# EAGLE design mimic1705 (EAGLE 7.5.0)
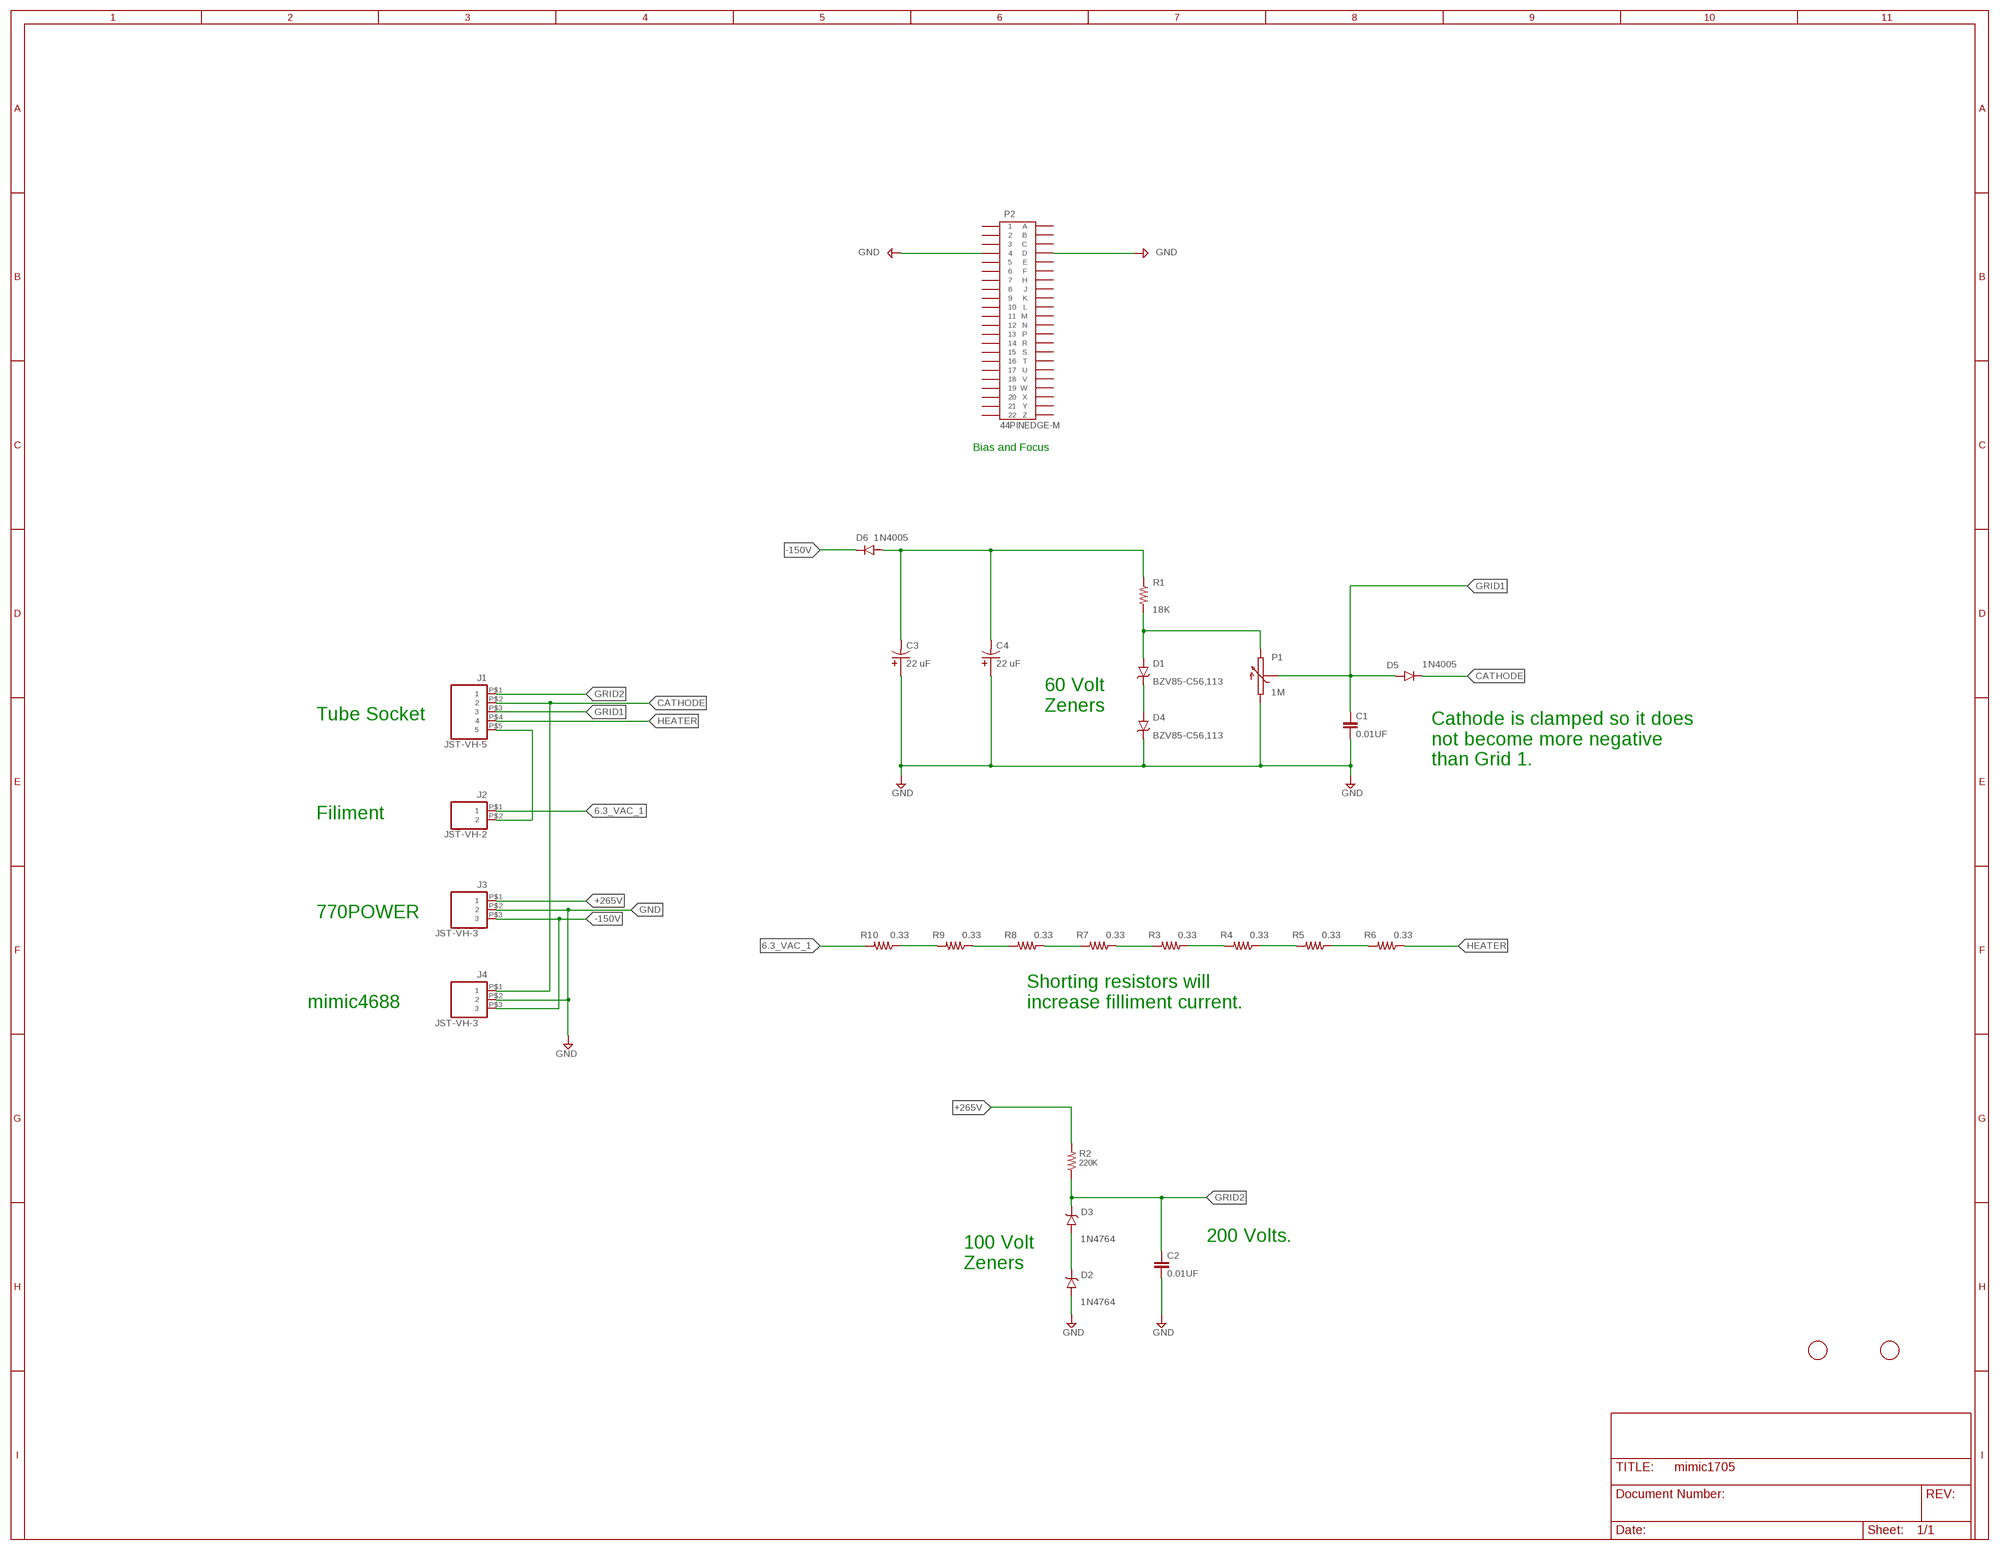
[diagram p0: schematic, sheet 1]

## Parts
C1  0.01UF  CAP_5MM  [5MM_TH]
C2  0.01UF  CAP_5MM  [5MM_TH]
C3  22 uF  CAP100UF200V  [AXIAL10X26]
C4  22 uF  CAP100UF200V  [AXIAL10X26]
D1  BZV85-C56,113  [DO-41-10]
D2  1N4764  1N4764A  [DO-41-10]
D3  1N4764  1N4764A  [DO-41-10]
D4  BZV85-C56,113  [DO-41-10]
D5  1N4005  1N400X  [DO-41-10]
D6  1N4005  1N400X  [DO-41-10]
J1  JST-VH-5  [VHR-5N]
J2  JST-VH-2  [VHR-2N]
J3  JST-VH-3  [VHR-3N]
J4  JST-VH-3  [VHR-3N]
P1  1M  POT-3006P  [3006P]
P2  44PINEDGE-M  [44PINEDGE]
R1  18K  RES-V  [0207/10]
R2  220K  RES-V  [0207/10]
R3  0.33  R-1/2WATT  [0309/12]
R4  0.33  R-1/2WATT  [0309/12]
R5  0.33  R-1/2WATT  [0309/12]
R6  0.33  R-1/2WATT  [0309/12]
R7  0.33  R-1/2WATT  [0309/12]
R8  0.33  R-1/2WATT  [0309/12]
R9  0.33  R-1/2WATT  [0309/12]
R10  0.33  R-1/2WATT  [0309/12]
U$1  FIDUCIAL  [FIDUCIAL_1MM]
U$2  FIDUCIAL  [FIDUCIAL_1MM]

## Nets
6.3_VAC_1: J2.P$1 R10.2
6.3_VAC_2: J1.P$5 J2.P$2
+265V: J3.P$1 R2.2
-150V: D6.C J3.P$3 J4.P$3
CATHODE: D5.C J1.P$2 J4.P$1
GND: C1.2 C2.2 C3.P$1 C4.P$1 D2.A D4.C J3.P$2 J4.P$2 P1.1 P2.4 P2.D
GRID1: C1.1 D5.A J1.P$3 P1.2
GRID2: C2.1 D3.C J1.P$1 R2.1
HEATER: J1.P$4 R6.1
N$1: D1.C D4.A
N$2: D2.C D3.A
N$5: R9.2 R10.1
N$7: D1.A P1.3 R1.2
N$8: C3.P$2 C4.P$2 D6.A R1.1
N$9: R8.2 R9.1
N$10: R7.2 R8.1
N$11: R3.2 R7.1
N$12: R3.1 R4.2
N$13: R4.1 R5.2
N$14: R5.1 R6.2
Unconnected: P2.1 P2.2 P2.3 P2.5 P2.6 P2.7 P2.8 P2.9 P2.10 P2.11 P2.12 P2.13 P2.14 P2.15 P2.16 P2.17 P2.18 P2.19 P2.20 P2.21 P2.22 P2.A P2.B P2.C P2.E P2.F P2.H P2.J P2.K P2.L P2.M P2.N P2.P P2.R P2.S P2.T P2.U P2.V P2.W P2.X P2.Y P2.Z

## Notes on the sheet
- Bias and Focus
- 60 Volt 
  Zeners
- Tube Socket
- Cathode is clamped so it does 
  not become more negative 
  than Grid 1.
- Filiment
- 770POWER
- mimic4688
- Shorting resistors will 
  increase filliment current.
- 200 Volts.
- 100 Volt 
  Zeners

## Library data of the parts
C1 C2 = keiths:CAP_5MM: Through hole radial, 5m pin spacing.
C3 C4 = keiths:CAP100UF200V: Axial lead electrolytic cap. Illinois Capacitor 107TTA100M; PN: TVX2C220MCD
D1 D4 = keiths:BZV85-C56,113: BZV85 series 60 Volt regulator diode
D2 D3 = keiths:1N4764A: Zener Diodes 100 Volt 1.3 Watt
D5 D6 = keiths:1N400X: 1N4001 - 1N4007 general purpose rectifier
J1 = keiths:JST-VH-5: JST CONN HEADER VH SIDE 5POS 3.96MM
J2 = keiths:JST-VH-2: JST CONN HEADER VH SIDE 2POS 3.96MM
J3 J4 = keiths:JST-VH-3: JST CONN HEADER VH SIDE 3POS 3.96MM
P1 = keiths:POT-3006P: 3006 - Trimpot® Trimming Potentiometer. Clockwise turn moves wiper to pin 3
P2 = keiths:44PINEDGE-M: 44 PIN EDGE CONNECTOR FOR PCB
R1 R2 = keiths:RES-V: 1/4 watt through hole size
R3-R10 = keiths:R-1/2WATT: Half watt through hole resistor.
U$1 U$2 = adafruit:FIDUCIAL: For use by pick and place machines to calibrate the vision/machine, 1mm By microbuilder.eu

## Board
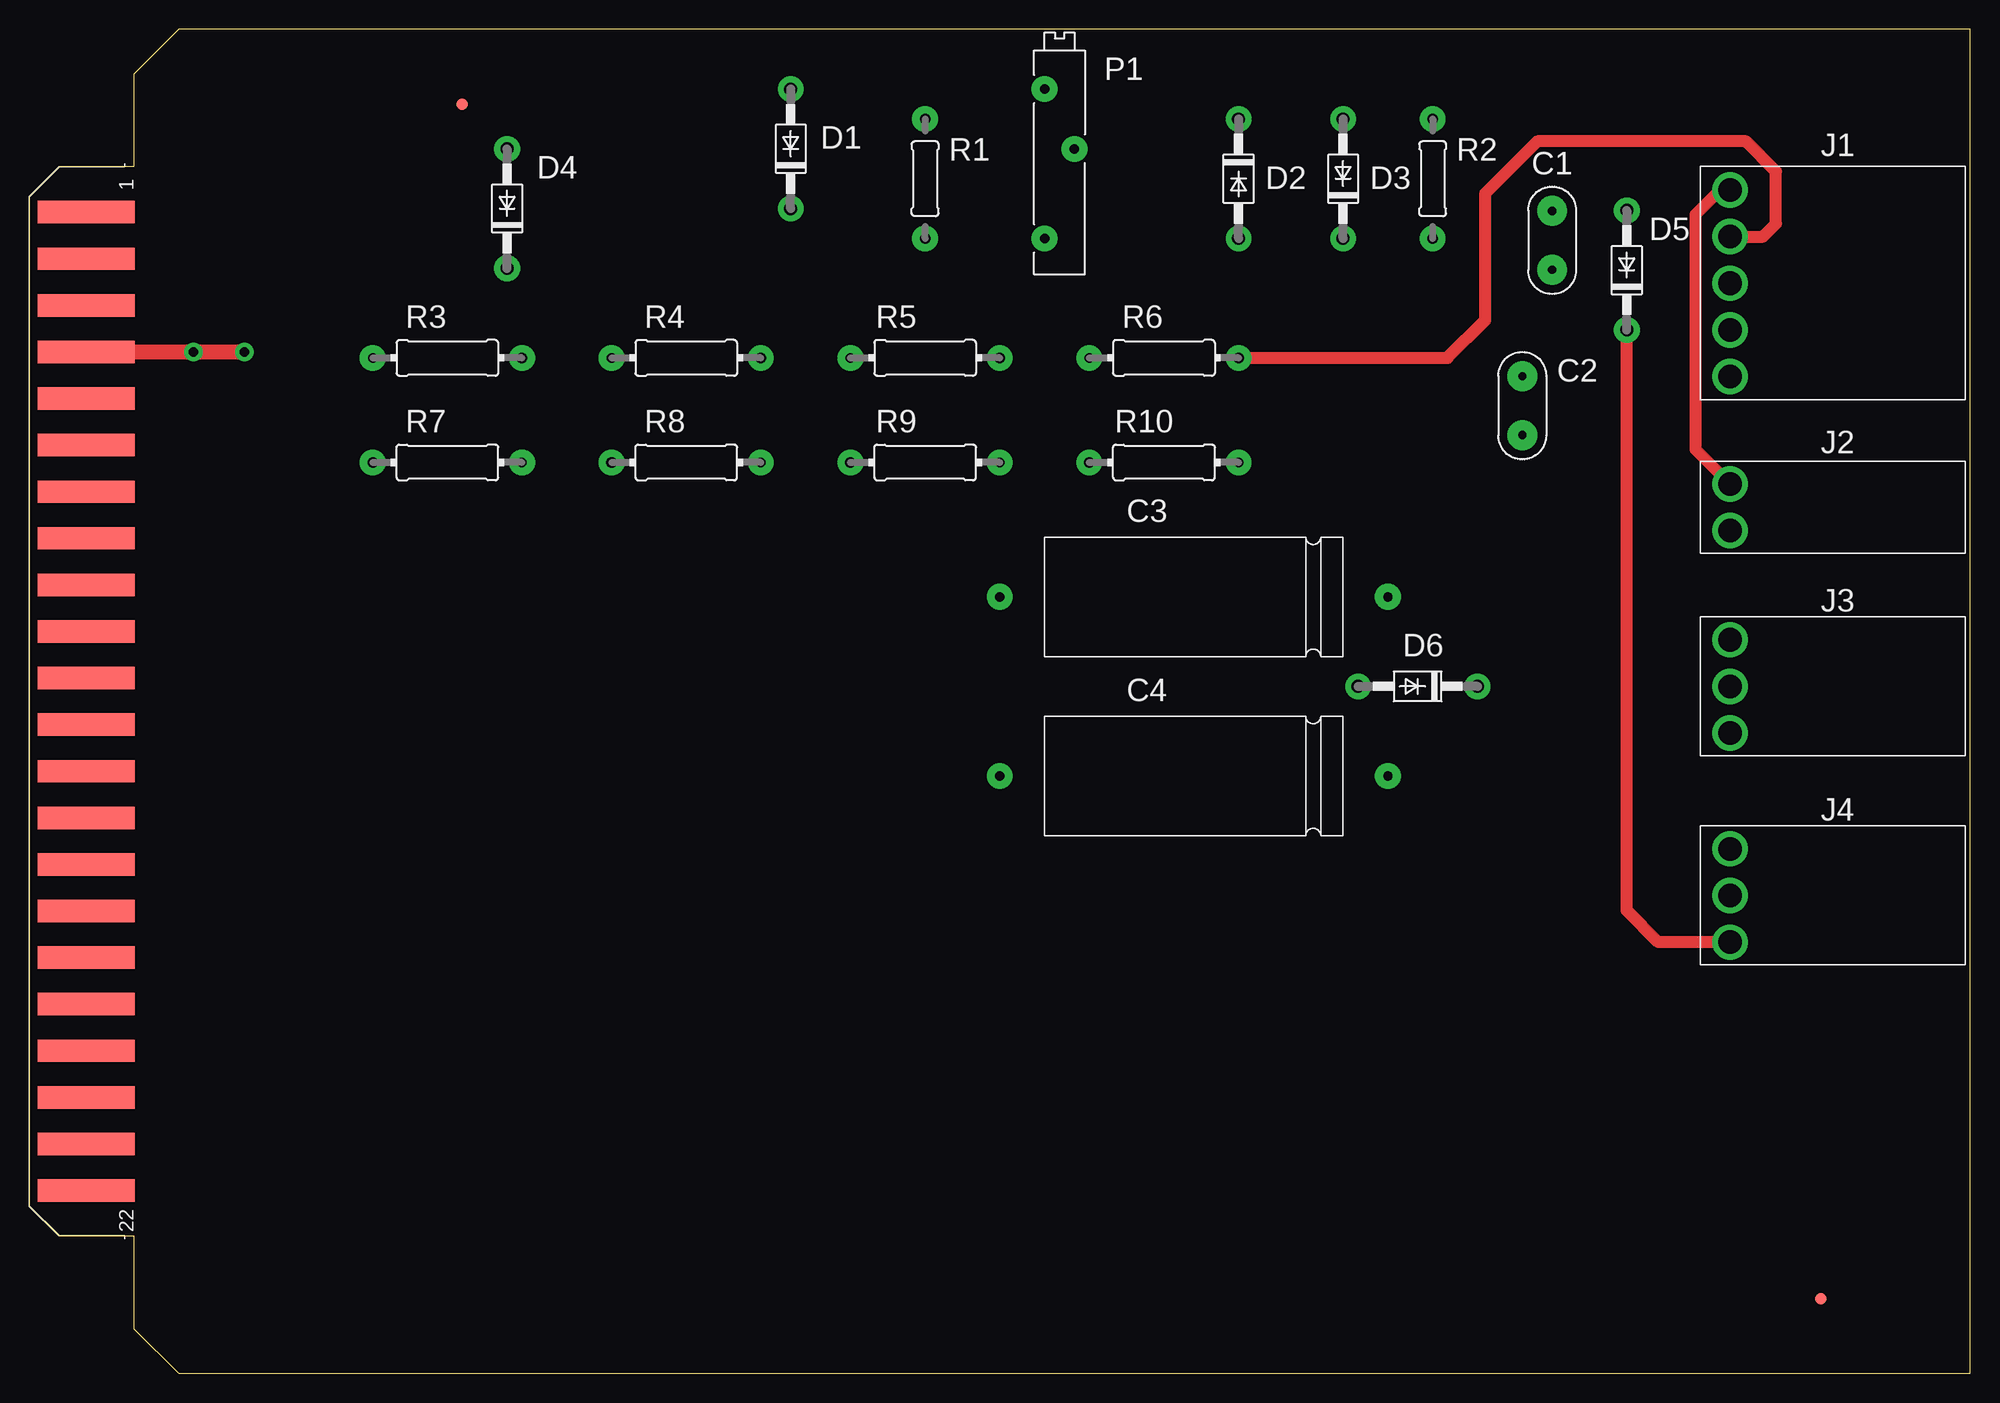
[diagram p1: board, top side]
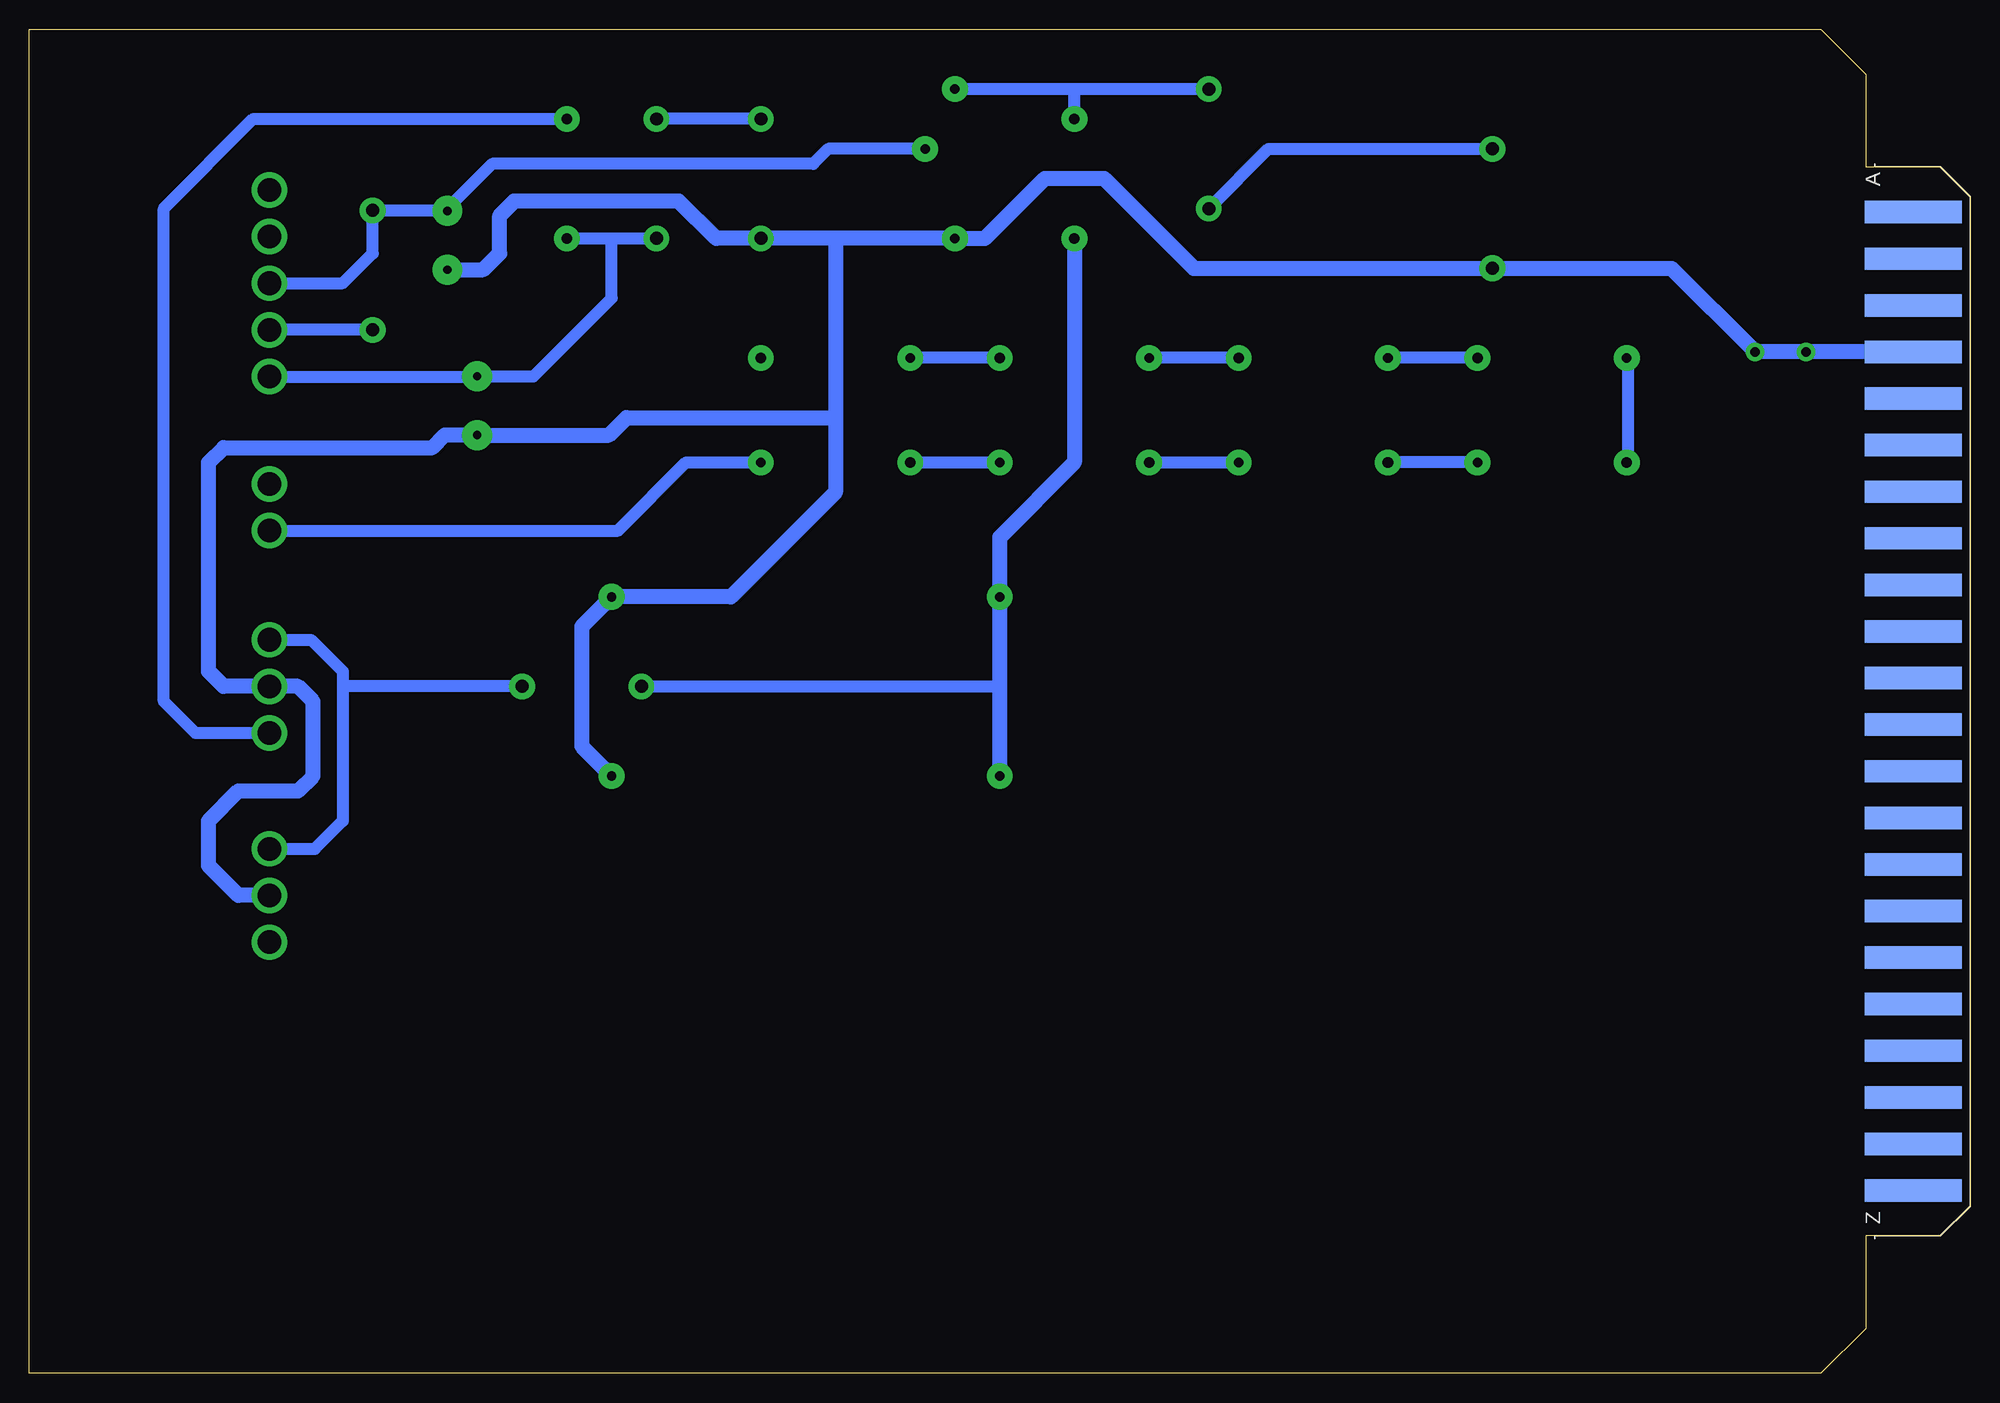
[diagram p2: board, bottom side, seen from below]

Size 165.1 x 114.3 mm. Coordinates in mm from the lower left corner, seen from the top.
Outline: 2.54,11.68 8.89,11.68 8.89,3.81 12.7,0 165.1,0 165.1,114.3 12.7,114.3 8.89,110.49 8.89,102.62 2.54,102.62 0,100.08 0,14.22 2.54,11.68
Copper layers (1*16): Top 0.035mm / dielectric 1.5mm / Bottom 0.035mm
Design rules "two_layer_th *": minimum track width 32mil, minimum drill 26mil, track to track 30mil, track to pad 30mil, pad to pad 30mil, via to via 30mil, smd to smd 30mil, copper to edge 20mil, drill to drill 20mil, minimum pad ring 10mil, minimum via ring 15mil, stop-mask expansion 4mil, vias tented up to drill 0mil, thermal gap 10mil

### Footprints (pad centres in the part's own frame; a part is rotated, then mirrored left to right if it is on the bottom)
5MM_TH = drill 0.7 pad 2.54: 1 -2.5,0; 2 2.5,0
AXIAL10X26 = drill 0.8 pad 2.184: P$1 16.51,0; P$2 -16.51,0
DO-41-10 = drill 1.1 pad 2.184: A 5.08,0; C -5.08,0
VHR-5N = drill 2: P$1 -9,-7.938; P$2 -9,-3.969; P$3 -9,0; P$4 -9,3.969; P$5 -9,7.938
VHR-2N = drill 2: P$1 -9,-1.984; P$2 -9,1.984
VHR-3N = drill 2: P$1 -9,-3.969; P$2 -9,0; P$3 -9,3.969
3006P = drill 0.8 pad 2.184: 1 -6.477,1.27; 2 1.143,-1.27; 3 6.223,1.27
44PINEDGE = smd 1.905 x 8.255: 1 -41.605,4.826; 2 -37.643,4.826; 3 -33.68,4.826; 4 -29.718,4.826; 5 -25.756,4.826; 6 -21.793,4.826; 7 -17.831,4.826; 8 -13.868,4.826; 9 -9.906,4.826; 10 -5.944,4.826; 11 -1.981,4.826; 12 1.981,4.826; 13 5.944,4.826; 14 9.906,4.826; 15 13.868,4.826; 16 17.831,4.826; 17 21.793,4.826; 18 25.756,4.826; 19 29.718,4.826; 20 33.68,4.826; 21 37.643,4.826; 22 41.605,4.826 | smd 1.905 x 8.255 bottom: A -41.605,4.826; B -37.643,4.826; C -33.68,4.826; D -29.718,4.826; E -25.756,4.826; F -21.793,4.826; H -17.831,4.826; J -13.868,4.826; K -9.906,4.826; L -5.944,4.826; M -1.981,4.826; N 1.981,4.826; P 5.944,4.826; R 9.906,4.826; S 13.868,4.826; T 17.831,4.826; U 21.793,4.826; V 25.756,4.826; W 29.718,4.826; X 33.68,4.826; Y 37.643,4.826; Z 41.605,4.826
0207/10 = drill 0.9 pad 2.184: 1 0,-5.08; 2 0,5.08
0309/12 = drill 0.9 pad 2.184: 1 -6.35,0 | drill 0.813 pad 2.184: 2 6.35,0
FIDUCIAL_1MM = smd 1 x 1: 1 0,0

### Placement (x,y rotation side)
C1  129.54,96.36 270 top
C2  127,82.3 270 top
C3  99.06,66.04 0 top
C4  99.06,50.8 0 top
D1  64.77,104.14 90 top
D2  102.87,101.6 270 top
D3  111.76,101.6 90 top
D4  40.64,99.06 90 top
D5  135.89,93.82 90 top
D6  118.11,58.42 180 top
J1  153.67,92.71 0 top
J2  153.67,73.66 0 top
J3  153.67,58.42 0 top
J4  153.67,40.64 0 top
P1  87.63,103 90 top
P2  0,57.15 270 top
R1  76.2,101.6 0 top
R2  119.38,101.6 0 top
R3  35.56,86.36 180 top
R4  55.88,86.36 180 top
R5  76.2,86.36 180 top
R6  96.52,86.36 180 top
R7  35.56,77.47 0 top
R8  55.88,77.47 0 top
R9  76.2,77.47 0 top
R10  96.52,77.47 0 top
U$1  36.83,107.95 0 top
U$2  152.4,6.35 0 top

### Tracks (layer width: path | path; a pad name or v marks a point on that pad's centre or on a via)
6.3_VAC_1
  Bottom 1.016: J2.P$1 115.01,71.68 109.22,77.47 R10.2
6.3_VAC_2
  Top 1.016: J2.P$2 141.73,78.58 141.73,98.55 143.51,100.33 144.35,100.33 J1.P$5
+265V
  Bottom 1.016: J3.P$1 150.97,54.45 153.67,57.15 153.67,99.06 146.05,106.68 R2.2
-150V
  Bottom 1.016: J3.P$3 141.13,62.39 138.43,59.69 138.43,58.42 | 138.43,58.42 138.43,46.99 140.81,44.61 J4.P$3 | D6.C 138.43,58.42
CATHODE
  Top 1.016: D5.C 135.89,39.37 138.59,36.67 J4.P$1
  Bottom 1.016: D5.C J1.P$2
GND  (via drill 0.8)
  Top 0.813: 13.97,87 v13.97,86.87
  Top 1.27: P2.4 v13.97,86.87 v18.29,86.87
  Bottom 1.27: C1.2 126.48,93.86 125.09,95.25 125.09,98.47 123.86,99.69 109.86,99.69 106.68,96.52 D2.A 96.52,96.52 | J4.P$2 147.32,40.64 149.86,43.18 149.86,46.99 147.32,49.53 142.24,49.53 140.97,50.8 140.97,57.15 142.24,58.42 J3.P$2 148.59,58.42 149.86,59.69 149.86,77.47 148.59,78.74 130.81,78.74 129.75,79.8 C2.2 115.78,79.8 114.3,81.28 96.52,81.28 | P2.4 v18.29,86.87 25.4,93.98 D4.C 66.04,93.98 73.66,101.6 78.74,101.6 83.82,96.52 P1.1 96.52,96.52 | 96.52,96.52 96.52,81.28 | 96.52,81.28 96.52,74.93 105.41,66.04 C3.P$1 118.11,63.5 118.11,53.34 C4.P$1
GRID1
  Bottom 1.016: J1.P$3 138.43,92.71 135.89,95.25 D5.A 129.58,98.9 C1.1 129.74,98.86 125.73,102.87 98.42,102.87 97.16,104.14 P1.2
GRID2
  Bottom 1.016: J1.P$1 127.02,84.77 C2.1 122.21,84.8 115.57,91.44 115.57,96.52 | 115.57,96.52 D3.C | R2.1 115.57,96.52
HEATER
  Top 1.016: J1.P$4 147.48,96.68 148.59,97.79 148.59,102.23 146.05,104.78 128.27,104.78 123.83,100.33 123.83,89.53 120.65,86.36 R6.1
N$1
  Bottom 1.016: D1.C 59.69,104.14 D4.A
N$2
  Bottom 1.016: D2.C D3.A
N$5
  Bottom 1.016: R10.1 R9.2
N$7
  Bottom 1.016: D1.A 76.2,109.22 | 76.2,109.22 P1.3 | R1.2 76.2,109.22
N$8
  Bottom 1.016: D6.A 82.55,58.42
  Bottom 1.27: R1.1 76.2,77.47 82.55,71.12 C3.P$2 82.55,58.42 C4.P$2
N$9
  Bottom 1.016: R9.1 R8.2
N$10
  Bottom 1.016: R7.2 R8.1
N$11
  Bottom 0.813: R3.2 29.21,86.2 29.13,85.83
  Bottom 1.016: 29.13,85.83 29.13,77.55 R7.1
N$12
  Bottom 1.016: R3.1 R4.2
N$13
  Bottom 1.016: R4.1 R5.2
N$14
  Bottom 1.016: R5.1 R6.2

### Text on the board
logo: board type 1705 / bias and focus